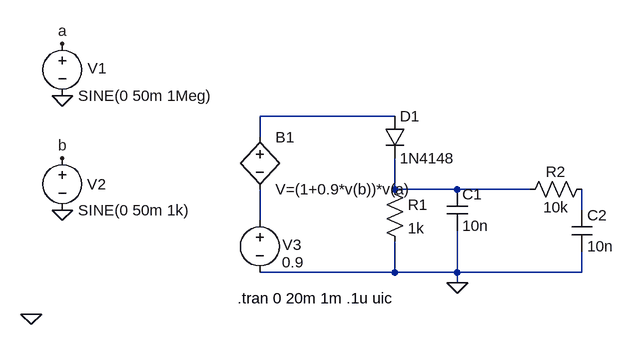
[diagram p0: schematic Draft1.asc]
Draft1.asc, the LTspice schematic file:
Version 4
SHEET 1 880 680
WIRE 192 112 -16 112
WIRE -16 144 -16 112
WIRE 192 224 192 176
WIRE 288 224 192 224
WIRE 400 224 288 224
WIRE 480 256 480 224
WIRE -16 272 -16 224
WIRE 192 352 192 304
WIRE 192 352 -16 352
WIRE 288 352 288 288
WIRE 288 352 192 352
WIRE 480 352 480 320
WIRE 480 352 288 352
WIRE 288 368 288 352
FLAG 288 368 0
FLAG -320 80 0
FLAG -320 256 0
FLAG -368 416 0
FLAG -320 0 a
FLAG -320 176 b
SYMBOL diode 176 112 R0
SYMATTR InstName D1
SYMATTR Value 1N4148
SYMBOL voltage -320 -16 R0
WINDOW 0 39 54 Left 0
WINDOW 123 0 0 Left 0
WINDOW 39 0 0 Left 0
SYMATTR InstName V1
SYMATTR Value SINE(0 50m 1Meg)
SYMBOL voltage -320 160 R0
WINDOW 0 38 56 Left 0
WINDOW 123 0 0 Left 0
WINDOW 39 0 0 Left 0
SYMATTR InstName V2
SYMATTR Value SINE(0 50m 1k)
SYMBOL voltage -16 256 R0
WINDOW 0 35 53 Left 0
WINDOW 3 34 80 Left 0
WINDOW 123 0 0 Left 0
WINDOW 39 0 0 Left 0
SYMATTR InstName V3
SYMATTR Value 0.9
SYMBOL res 176 208 R0
SYMATTR InstName R1
SYMATTR Value 1k
SYMBOL cap 272 224 R0
SYMATTR InstName C1
SYMATTR Value 10n
SYMBOL res 496 208 R90
WINDOW 0 5 56 VBottom 0
WINDOW 3 28 56 VTop 0
SYMATTR InstName R2
SYMATTR Value 10k
SYMBOL cap 464 256 R0
SYMATTR InstName C2
SYMATTR Value 10n
SYMBOL bv -16 128 R0
SYMATTR InstName B1
SYMATTR Value V=(1+0.9*v(b))*v(a)
TEXT -50 392 Left 0 !.tran 0 20m 1m .1u uic

The netlist it stands for:
* Draft1.asc
D1 N001 N002 1N4148
V1 a 0 SINE(0 50m 1Meg)
V2 b 0 SINE(0 50m 1k)
V3 N004 0 0.9
R1 N002 0 1k
C1 N002 0 10n
R2 N003 N002 10k
C2 N003 0 10n
B1 N001 N004 V=(1+0.9*v(b))*v(a)
.model D D
.lib standard.dio
.tran 0 20m 1m .1u uic
.backanno
.end